# EAGLE design imu (EAGLE 7.2.0)
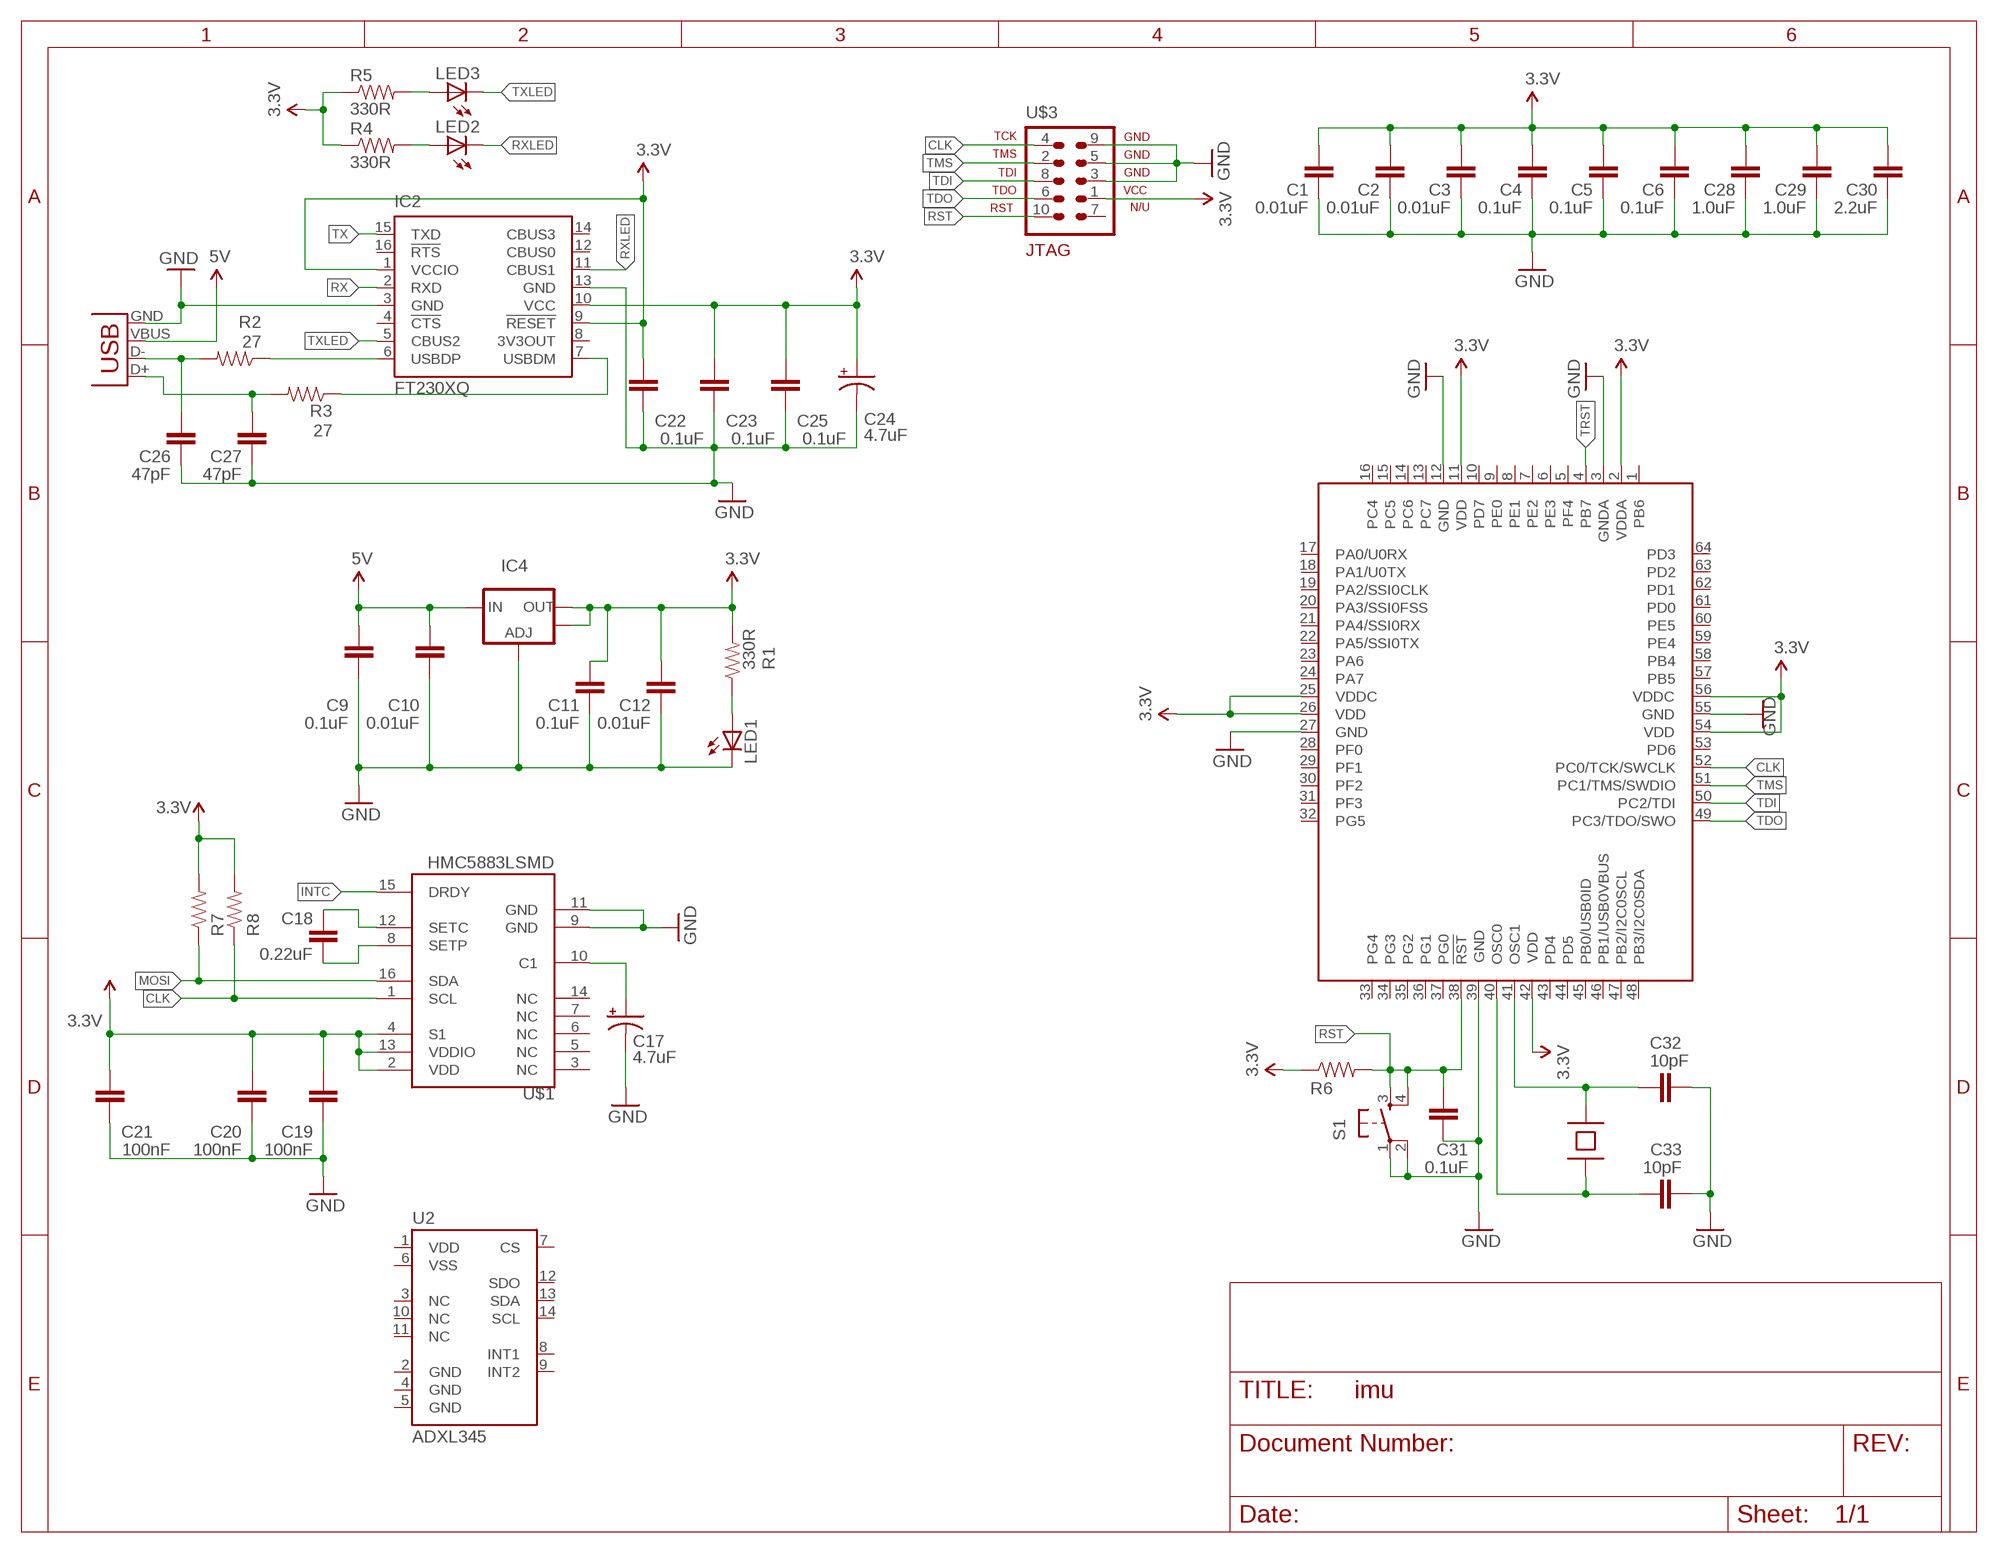
[diagram p0: schematic, sheet 1]

## Parts
C1  0.01uF  CAP0603-CAP  [0603-CAP]
C2  0.01uF  CAP0603-CAP  [0603-CAP]
C3  0.01uF  CAP0603-CAP  [0603-CAP]
C4  0.1uF  CAP0603-CAP  [0603-CAP]
C5  0.1uF  CAP0603-CAP  [0603-CAP]
C6  0.1uF  CAP0603-CAP  [0603-CAP]
C9  0.1uF  CAP0603-CAP  [0603-CAP]
C10  0.01uF  CAP0603-CAP  [0603-CAP]
C11  0.1uF  CAP0603-CAP  [0603-CAP]
C12  0.01uF  CAP0603-CAP  [0603-CAP]
C17  4.7uF  CAP_POL1206  [EIA3216]
C18  0.22uF  CAP0603-CAP  [0603-CAP]
C19  100nF  CAP0603-CAP  [0603-CAP]
C20  100nF  CAP0603-CAP  [0603-CAP]
C21  100nF  CAP0603-CAP  [0603-CAP]
C22  0.1uF  CAP0603-CAP  [0603-CAP]
C23  0.1uF  CAP0603-CAP  [0603-CAP]
C24  4.7uF  CAP_POL1206  [EIA3216]
C25  0.1uF  CAP0603-CAP  [0603-CAP]
C26  47pF  CAP0603-CAP  [0603-CAP]
C27  47pF  CAP0603-CAP  [0603-CAP]
C28  1.0uF  CAP0603-CAP  [0603-CAP]
C29  1.0uF  CAP0603-CAP  [0603-CAP]
C30  2.2uF  CAP0603-CAP  [0603-CAP]
C31  0.1uF  CAP0603-CAP  [0603-CAP]
C32  10pF  CAP0603-CAP  [0603-CAP]
C33  10pF  CAP0603-CAP  [0603-CAP]
IC1  TM4C123[6,F]XXPM  [PM_S-PQFP-G64]
IC2  FT230XQ  [QFN16]
IC4  V_REG_LM1117SOT223  [SOT223]
JP1  USBSMD  [USB-MINIB]
LED1  LED0603  [LED-0603]
LED2  LED0603  [LED-0603]
LED3  LED0603  [LED-0603]
R1  330R  RESISTOR0805-RES  [0805]
R2  27  RESISTOR0603-RES  [0603-RES]
R3  27  RESISTOR0603-RES  [0603-RES]
R4  330R  RESISTOR0603-RES  [0603-RES]
R5  330R  RESISTOR0603-RES  [0603-RES]
R6  RESISTOR0603-RES  [0603-RES]
R7  RESISTOR0603-RES  [0603-RES]
R8  RESISTOR0603-RES  [0603-RES]
S1  TAC_SWITCHSMD  [TACTILE_SWITCH_SMD]
U2  ADXL345  [LGA14]
U$1  HMC5883LSMD  [16LPCC]
U$2  SMDCRYSTAL3225  [IQG3225]
U$3  ARM10JTAG  [AVR-JTAG-10]

## Nets
3.3V: C1.2 C2.2 C3.2 C4.2 C5.2 C6.2 C11.2 C12.2 C19.2 C20.2 C21.2 C22.2 C23.2 C24.A(+) C25.2 C28.2 C29.2 C30.2 IC1.2(VDDA) IC1.11(VDD) IC1.25(VDDC) IC1.26(VDD) IC1.42(VDD) IC1.54(VDD) IC1.56(VDDC) IC2.1(VCCIO) IC2.9(!RESET) IC2.10(VCC) IC4.2(OUT) IC4.4(OUT) R1.2 R4.1 R5.1 R6.1 R7.2 R8.2 U$1.2(VDD) U$1.4(S1) U$1.13(VDDIO) U$3.1
5V: C9.2 C10.2 IC4.3(IN) JP1.VBUS
CLK: IC1.52(PC0/TCK/SWCLK) R8.1 U$1.1(SCL) U$3.4
GND: C1.1 C2.1 C3.1 C4.1 C5.1 C6.1 C9.1 C10.1 C11.1 C12.1 C17.C(-) C19.1 C20.1 C21.1 C22.1 C23.1 C24.C(-) C25.1 C26.1 C27.1 C28.1 C29.1 C30.1 C31.1 C32.1 C33.2 IC1.3(GNDA) IC1.12(GND) IC1.27(GND) IC1.39(GND) IC1.55(GND) IC2.3(GND) IC2.13(GND) IC4.1(ADJ) JP1.GND LED1.C S1.1 S1.2 U$1.9(GND) U$1.11(GND) U$3.3 U$3.5 U$3.9
INTC: U$1.15(DRDY)
MOSI: R7.1 U$1.16(SDA)
N$2: IC2.6(USBDP) R2.1
N$4: LED2.A R4.2
N$6: IC2.7(USBDM) R3.1
N$7: C26.2 JP1.D- R2.2
N$8: C17.A(+) U$1.10(C1)
N$9: C18.2 U$1.12(SETC)
N$10: C18.1 U$1.8(SETP)
N$11: C27.2 JP1.D+ R3.2
N$12: LED3.A R5.2
N$13: C32.2 IC1.41(OSC1) U$2.3
N$14: C33.1 IC1.40(OSC0) U$2.1
N$15: LED1.A R1.1
RST: C31.2 IC1.38(!RST) R6.2 S1.3 S1.4 U$3.10
RX: IC2.2(RXD)
RXLED: IC2.11(CBUS1) LED2.C
TDI: IC1.50(PC2/TDI) U$3.8
TDO: IC1.49(PC3/TDO/SWO) U$3.6
TMS: IC1.51(PC1/TMS/SWDIO) U$3.2
TRST: IC1.4(PB7)
TX: IC2.15(TXD)
TXLED: IC2.5(CBUS2) LED3.C
Unconnected: IC1.1(PB6) IC1.5(PF4) IC1.6(PE3) IC1.7(PE2) IC1.8(PE1) IC1.9(PE0) IC1.10(PD7) IC1.13(PC7) IC1.14(PC6) IC1.15(PC5) IC1.16(PC4) IC1.17(PA0/U0RX) IC1.18(PA1/U0TX) IC1.19(PA2/SSI0CLK) IC1.20(PA3/SSI0FSS) IC1.21(PA4/SSI0RX) IC1.22(PA5/SSI0TX) IC1.23(PA6) IC1.24(PA7) IC1.28(PF0) IC1.29(PF1) IC1.30(PF2) IC1.31(PF3) IC1.32(PG5) IC1.33(PG4) IC1.34(PG3) IC1.35(PG2) IC1.36(PG1) IC1.37(PG0) IC1.43(PD4) IC1.44(PD5) IC1.45(PB0/USB0ID) IC1.46(PB1/USB0VBUS) IC1.47(PB2/I2C0SCL) IC1.48(PB3/I2C0SDA) IC1.53(PD6) IC1.57(PB5) IC1.58(PB4) IC1.59(PE4) IC1.60(PE5) IC1.61(PD0) IC1.62(PD1) IC1.63(PD2) IC1.64(PD3) IC2.4(!CTS) IC2.8(3V3OUT) IC2.12(CBUS0) IC2.14(CBUS3) IC2.16(!RTS) U2.1(VDD) U2.2(GND) U2.3(NC) U2.4(GND) U2.5(GND) U2.6(VSS) U2.7(CS) U2.8(INT1) U2.9(INT2) U2.10(NC) U2.11(NC) U2.12(SDO) U2.13(SDA) U2.14(SCL) U$1.3(NC) U$1.5(NC) U$1.6(NC) U$1.7(NC) U$1.14(NC) U$3.7

## Library data of the parts
C1-C6 C9-C12 C18-C23 C25-C33 = SparkFun-Passives:CAP: Capacitor Standard 0603 ceramic capacitor, and 0.1" leaded capacitor.
C17 C24 = SparkFun-Capacitors:CAP_POL: Capacitor Polarized These are standard SMD and PTH capacitors. Normally 10uF, 47uF, and 100uF in electrolytic and tantalum varieties. Always verify the external diameter of the through hole cap, it varies with capacity, voltage, and manufacturer. The EIA devices should be standard.
IC1 = ti-tiva:TM4C123[6,F]XX
IC2 = ftdichip:FT230X: USB to BASIC UART IC Auto generated by make-symbol-device-package-bsdl.ulp Rev. 43 Source: Data sheet <http://www.ftdichip.com/Support/Documents/DataSheets/ICs/DS_FT230X.pdf>
IC4 = SparkFun-PowerIC:V_REG_LM1117: Voltage Regulator LM1117 Standard adjustable voltage regulator but in SMD form. Spark Fun Electronics SKU : COM-00595
JP1 = SparkFun-Connectors:USB: USB Connectors USB-B-PTH is fully proven SKU : PRT-00139/CONN-08278 USB-miniB is fully proven SKU : PRT-00587 USB-A-PCB is untested. USB-A-H is throughly reviewed, but untested. Spark Fun Electronics SKU : PRT-00437 USB-B-SMT is throughly reviewed, but untested. Needs silkscreen touching up. USB-A-S has not been used/tested USB-MB-H has not been used/tested USB-MICROB has been used. CONN-09505; PROD_ID: CONN-08193
LED1-LED3 = SparkFun-LED:LED: LEDs Standard schematic elements and footprints for 5mm, 3mm, 1206, and 0603 sized LEDs. 5mm - Spark Fun Electronics SKU : COM-00529 (and others)
R1-R8 = SparkFun-Resistors:RESISTOR: Resistor Basic schematic elements and footprints for 0603, 1206, and PTH resistors.
S1 = SparkFun-Electromechanical:TAC_SWITCH: Momentary Switch Button commonly used for reset or general input. Spark Fun Electronics SKU : COM-00097 SMT- SWCH-08247; PROD_ID: SWCH-08247
U2 = SparkFun-Sensors:ADXL345: 3-axis SPI/I2C 2/4/8/16g accelerometer
U$1 = SparkFun-Sensors:HMC5883L: 3 Axis Digital Compass IC
U$2 = cagatay:SMDCRYSTAL3225
U$3 = cagatay:ARM10JTAG

## Board
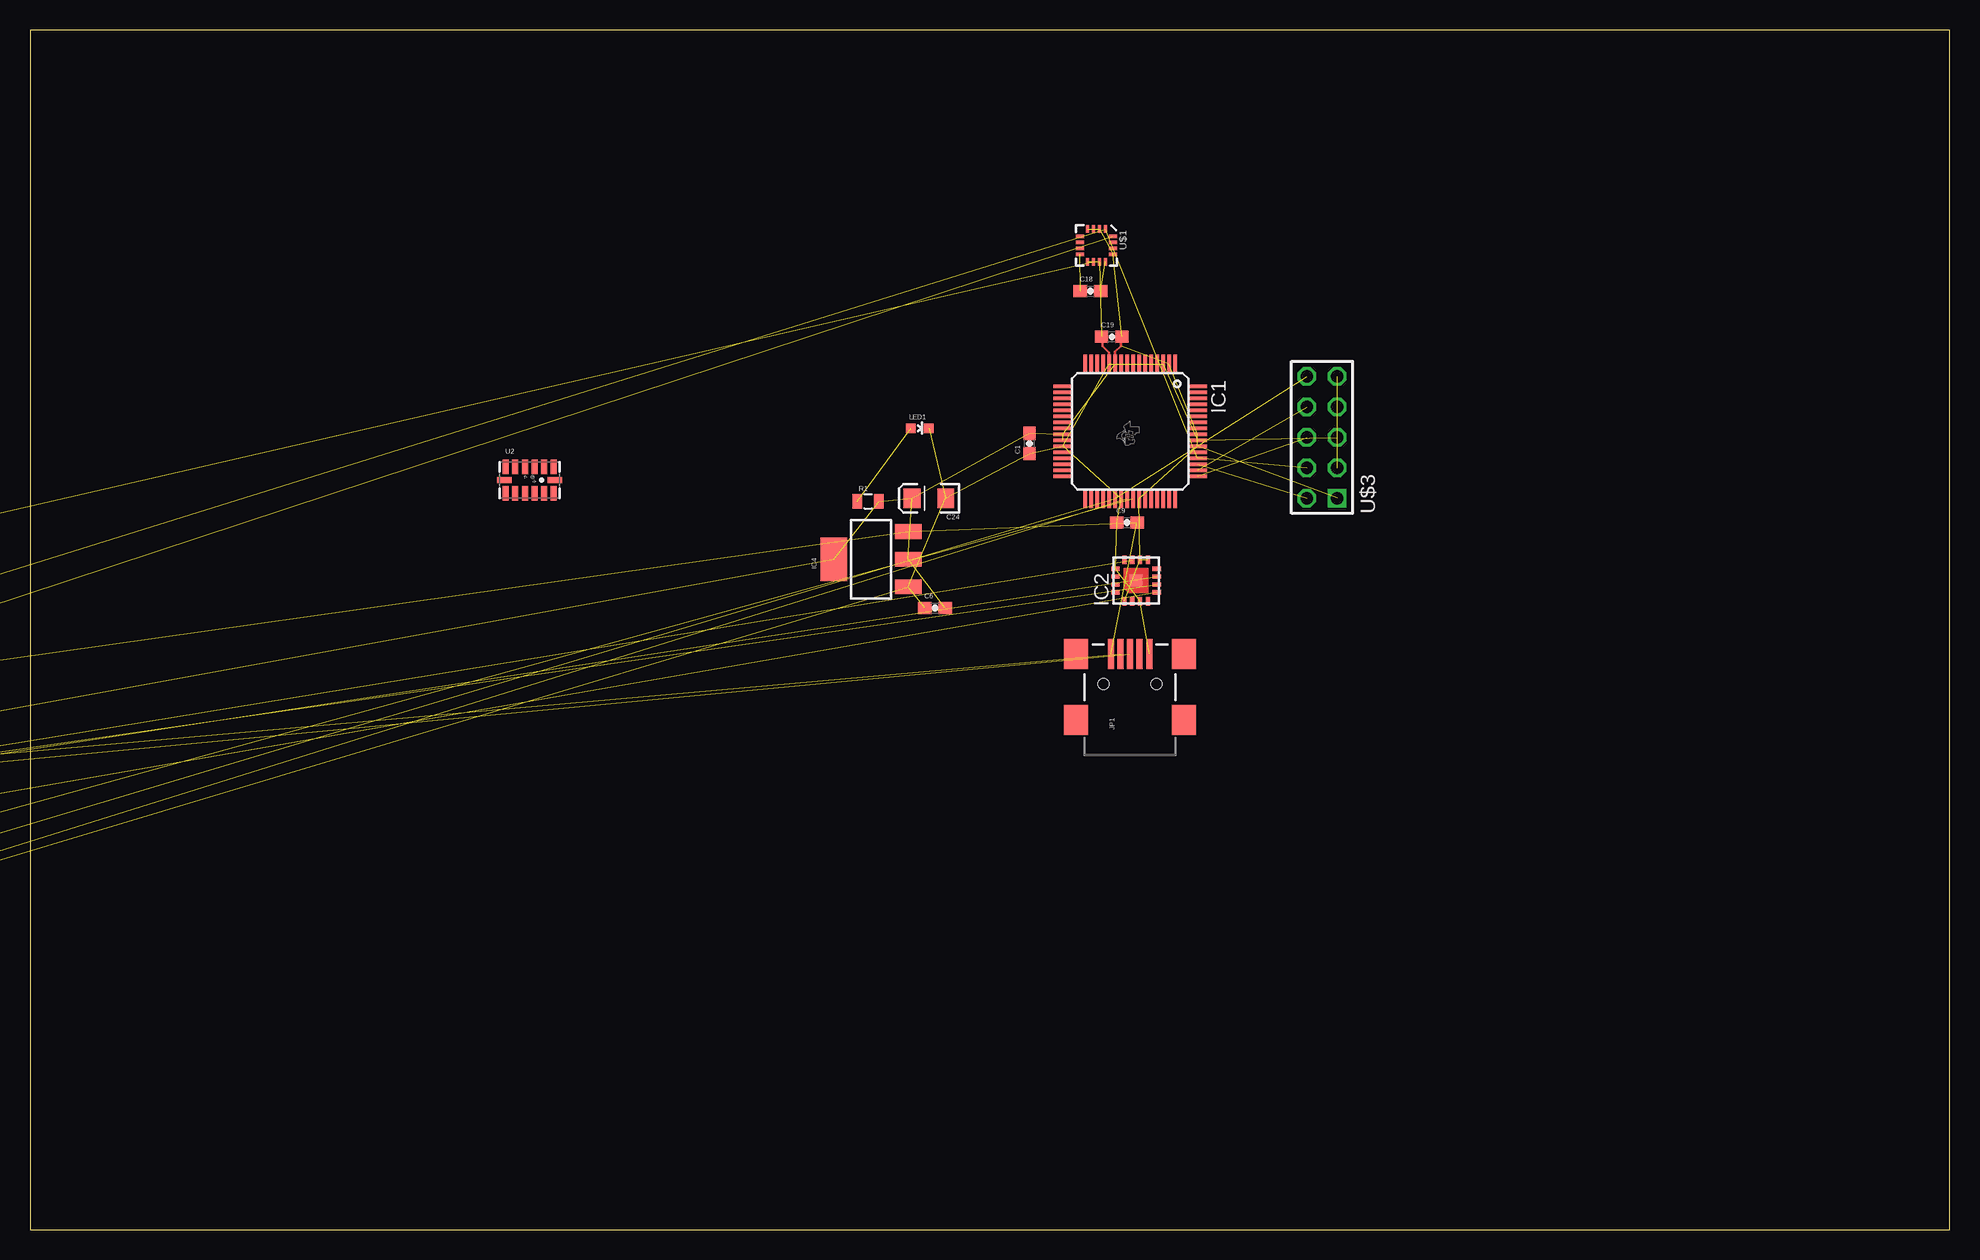
[diagram p1: board, top side]

Size 160 x 100 mm. Coordinates in mm from the lower left corner, seen from the top.
Outline: 0,0 160,0 160,100 0,100 0,0
Copper layers (1*2*15*16): Top 0.035mm / dielectric 0.2mm / Route2 0.0175mm / dielectric 0.3mm / Route15 0.0175mm / dielectric 0.2mm / Bottom 0.035mm
Design rules "seed4layer": minimum track width 8mil, minimum drill 0.2mm, track to track 8mil, track to pad 8mil, pad to pad 8mil, via to via 8mil, smd to smd 0mil, copper to edge 8mil, drill to drill 8mil, minimum pad ring 6mil, minimum via ring 4mil, stop-mask expansion 4mil, vias tented up to drill 100mil, thermal gap 10mil

### Footprints (pad centres in the part's own frame; a part is rotated, then mirrored left to right if it is on the bottom)
0603-CAP = smd 1.1 x 1: 1 -0.85,0; 2 0.85,0
EIA3216 = smd 1.4 x 1.6: A 1.4,0; C -1.4,0
PM_S-PQFP-G64 = smd 1.6 x 0.3: 1 -5.6,3.75; 2 -5.6,3.25; 3 -5.6,2.75; 4 -5.6,2.25; 5 -5.6,1.75; 6 -5.6,1.25; 7 -5.6,0.75; 8 -5.6,0.25; 9 -5.6,-0.25; 10 -5.6,-0.75; 11 -5.6,-1.25; 12 -5.6,-1.75; 13 -5.6,-2.25; 14 -5.6,-2.75; 15 -5.6,-3.25; 16 -5.6,-3.75; 33 5.6,-3.75; 34 5.6,-3.25; 35 5.6,-2.75; 36 5.6,-2.25; 37 5.6,-1.75; 38 5.6,-1.25; 39 5.6,-0.75; 40 5.6,-0.25; 41 5.6,0.25; 42 5.6,0.75; 43 5.6,1.25; 44 5.6,1.75; 45 5.6,2.25; 46 5.6,2.75; 47 5.6,3.25; 48 5.6,3.75 | smd 0.3 x 1.6: 17 -3.75,-5.6; 18 -3.25,-5.6; 19 -2.75,-5.6; 20 -2.25,-5.6; 21 -1.75,-5.6; 22 -1.25,-5.6; 23 -0.75,-5.6; 24 -0.25,-5.6; 25 0.25,-5.6; 26 0.75,-5.6; 27 1.25,-5.6; 28 1.75,-5.6; 29 2.25,-5.6; 30 2.75,-5.6; 31 3.25,-5.6; 32 3.75,-5.6; 49 3.75,5.6; 50 3.25,5.6; 51 2.75,5.6; 52 2.25,5.6; 53 1.75,5.6; 54 1.25,5.6; 55 0.75,5.6; 56 0.25,5.6; 57 -0.25,5.6; 58 -0.75,5.6; 59 -1.25,5.6; 60 -1.75,5.6; 61 -2.25,5.6; 62 -2.75,5.6; 63 -3.25,5.6; 64 -3.75,5.6
QFN16 = smd 0.7 x 0.35: 1 -1.725,0.975; 2 -1.725,0.325; 3 -1.725,-0.325; 4 -1.725,-0.975; 9 1.725,-0.975; 10 1.725,-0.325; 11 1.725,0.325; 12 1.725,0.975 | smd 0.35 x 0.7: 5 -0.975,-1.725; 6 -0.325,-1.725; 7 0.325,-1.725; 8 0.975,-1.725; 13 0.975,1.725; 14 0.325,1.725; 15 -0.325,1.725; 16 -0.975,1.725 | smd 1 x 1: TAB 0,0
SOT223 = smd 1.219 x 2.235: 1 -2.311,-3.099; 2 0,-3.099; 3 2.311,-3.099 | smd 3.6 x 2.2: 4 0,3.099
USB-MINIB = smd 2.5 x 0.5: D+ 2.5,0; D- 2.5,0.8; GND 2.5,-1.6; ID 2.5,-0.8; VBUS 2.5,1.6 | smd 2.5 x 2: MTN1 -3,4.5; MTN2 2.5,4.5; MTN3 -3,-4.5; MTN4 2.5,-4.5 | hole 0.9: 0,2.2; 0,-2.2
LED-0603 = smd 0.8 x 0.8: A 0,-0.75; C 0,0.75
0805 = smd 0.8 x 1.2: 1 -0.9,0; 2 0.9,0
0603-RES = smd 1.1 x 1: 1 -0.85,0; 2 0.85,0
TACTILE_SWITCH_SMD = smd 2.032 x 1.27: 1 -2.794,1.905; 2 2.794,1.905; 3 -2.794,-1.905; 4 2.794,-1.905
LGA14 = smd 0.5 x 1.2: 1 2,1.1; 2 1.2,1.1; 3 0.4,1.1; 4 -0.4,1.1; 5 -1.2,1.1; 6 -2,1.1; 8 -2,-1.1; 9 -1.2,-1.1; 10 -0.4,-1.1; 11 0.4,-1.1; 12 1.2,-1.1; 13 2,-1.1 | smd 1.2 x 0.5: 7 -2.1,0; 14 2.1,0
16LPCC = smd 0.65 x 0.28: 1 -1.37,0.75; 2 -1.37,0.25; 3 -1.37,-0.25; 4 -1.37,-0.75; 9 1.37,-0.75; 10 1.37,-0.25; 11 1.37,0.25; 12 1.37,0.75 | smd 0.28 x 0.65: 5 -0.75,-1.37; 6 -0.25,-1.37; 7 0.25,-1.37; 8 0.75,-1.37; 13 0.75,1.37; 14 0.25,1.37; 15 -0.25,1.37; 16 -0.75,1.37
IQG3225 = smd 1.3 x 1.2: 1 -1.55,-0.7; 2 1.55,-0.7; 3 1.55,0.7; 4 -1.55,0.7
AVR-JTAG-10 = drill 1.016 square: 1 -5.08,-1.27 | drill 1.016 octagon: 2 -5.08,1.27; 3 -2.54,-1.27; 4 -2.54,1.27; 5 0,-1.27; 6 0,1.27; 7 2.54,-1.27; 8 2.54,1.27; 9 5.08,-1.27; 10 5.08,1.27

### Placement (x,y rotation side)
C1  83.31,65.53 90 top
C2  -32,40.89 0 top  (outside the outline)
C3  -35.05,40.89 0 top  (outside the outline)
C4  -38.1,40.89 0 top  (outside the outline)
C5  -38.1,38.61 0 top  (outside the outline)
C6  75.44,51.82 0 top
C9  91.44,58.93 0 top
C10  -32,43.43 0 top  (outside the outline)
C11  -35.05,43.43 0 top  (outside the outline)
C12  -38.1,43.43 0 top  (outside the outline)
C17  -37.59,50.29 90 top  (outside the outline)
C18  88.39,78.23 0 top
C19  90.17,74.42 0 top
C20  -35.05,45.72 0 top  (outside the outline)
C21  -38.1,45.72 0 top  (outside the outline)
C22  -32,36.58 0 top  (outside the outline)
C23  -28.96,38.61 0 top  (outside the outline)
C24  74.93,60.96 180 top
C25  -35.05,36.58 0 top  (outside the outline)
C26  -38.1,36.58 0 top  (outside the outline)
C27  -28.96,36.58 0 top  (outside the outline)
C28  -28.7,31.75 180 top  (outside the outline)
C29  -31.75,31.75 180 top  (outside the outline)
C30  -35.05,31.75 180 top  (outside the outline)
C31  -38.35,31.75 180 top  (outside the outline)
C32  -26.42,24.89 0 top  (outside the outline)
C33  -23.11,24.89 0 top  (outside the outline)
IC1  91.69,66.55 270 top
IC2  92.2,54.1 90 top
IC4  70.1,55.88 90 top
JP1  91.69,45.47 90 top
LED1  74.17,66.8 270 top
LED2  -19.56,36.83 0 top  (outside the outline)
LED3  -21.84,33.78 180 top  (outside the outline)
R1  69.85,60.71 0 top
R2  -38.1,34.54 0 top  (outside the outline)
R3  -35.05,34.54 0 top  (outside the outline)
R4  -32,34.54 0 top  (outside the outline)
R5  -28.96,34.54 0 top  (outside the outline)
R6  -38.61,29.46 0 top  (outside the outline)
R7  -40.39,40.64 90 top  (outside the outline)
R8  -40.39,43.69 90 top  (outside the outline)
S1  -33.02,26.67 0 top  (outside the outline)
U2  41.66,62.48 0 top
U$1  88.9,82.04 270 top
U$2  -26.42,27.94 0 top  (outside the outline)
U$3  107.7,66.04 90 top

### Tracks (layer width: path | path; a pad name or v marks a point on that pad's centre or on a via)
3.3V  (38 unrouted)
  Top 0.203: IC1.11 90.44,73.17 90.93,73.66 90.93,74.33 C19.2
5V  (3 unrouted)
CLK  (3 unrouted)
GND  (41 unrouted)
  Top 0.203: IC1.12 89.94,73.12 89.41,73.66 89.41,74.33 C19.1
MOSI  (1 unrouted)
N$2  (1 unrouted)
N$4  (1 unrouted)
N$6  (1 unrouted)
N$7  (2 unrouted)
N$8  (1 unrouted)
N$9  (1 unrouted)
N$10  (1 unrouted)
N$11  (2 unrouted)
N$12  (1 unrouted)
N$13  (2 unrouted)
N$14  (2 unrouted)
N$15  (1 unrouted)
RST  (5 unrouted)
RXLED  (1 unrouted)
TDI  (1 unrouted)
TDO  (1 unrouted)
TMS  (1 unrouted)
TXLED  (1 unrouted)